# EAGLE schematic MikroE-334 (EAGLE 9.2.2)
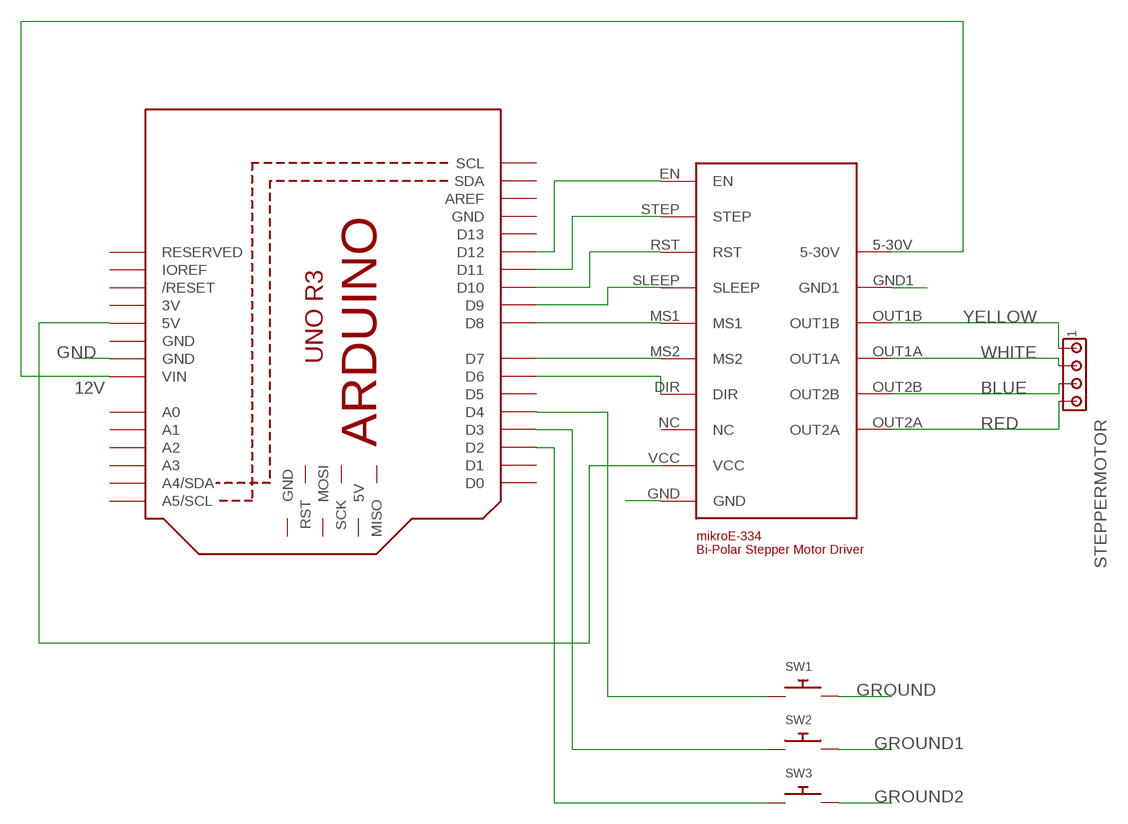
[diagram p0: schematic, sheet 1]

## Parts
M1  ARDUINO_R3_ICSP  [ARDUINOR3_ICSP]
STEPPERMOTOR  MTA04-156  [1X4MTA]
SW1  SWITCH_PUSHBUTTONEVQ-PE  [TACT_PANA-EVQ]
SW2  SWITCH_PUSHBUTTONEVQ-PE  [TACT_PANA-EVQ]
SW3  SWITCH_PUSHBUTTONEVQ-PE  [TACT_PANA-EVQ]
U$1  MIKROE-334  [MIKROE-334]

## Nets
12V: M1.VIN U$1.5-30V
BLUE: STEPPERMOTOR.3 U$1.OUT2B
GND: M1.GND@3(GND)
GROUND: SW1.P$2
GROUND1: SW2.P$2
GROUND2: SW3.P$2
N$1: M1.D12 U$1.EN
N$2: M1.D11 U$1.STEP
N$3: M1.D10 U$1.RST
N$4: M1.D9 U$1.SLEEP
N$5: M1.D8 U$1.MS1
N$6: M1.D7 U$1.MS2
N$7: M1.D6 U$1.DIR
N$9: U$1.GND1
N$10: M1.5V U$1.VCC
N$11: U$1.GND
N$12: M1.D4 SW1.P$1
N$13: M1.D3 SW2.P$1
N$14: M1.D2 SW3.P$1
RED: STEPPERMOTOR.4 U$1.OUT2A
WHITE: STEPPERMOTOR.2 U$1.OUT1A
YELLOW: STEPPERMOTOR.1 U$1.OUT1B
Unconnected: M1.5V_ICSP(5V) M1.A0 M1.A1 M1.A2 M1.A3 M1.A4(A4/SDA) M1.A5(A5/SCL) M1.AREF M1.D0 M1.D1 M1.D5 M1.D13 M1.GND@2(GND) M1.IOREF M1.MISO M1.MOSI M1.RESERVED M1.RESET(/RESET) M1.RESET_ICSP(RST) M1.SCK M1.SCL M1.SDA U$1.NC

## Power pins joined to a net without a drawn wire
3V: M1.3V
GND: M1.GND M1.GND@1(GND)

## Library data of the parts
M1 = adafruit:ARDUINO_R3_ICSP
STEPPERMOTOR = con-amp:MTA04-156: AMP connector
SW1-SW3 = adafruit:SWITCH_PUSHBUTTON: Buttons SOFTTOUCHSMD_SJ - Soft touch temporary push button (Super Junk Akihabara) Compatible with SKPMANE010 [Mouser: 688-SKPMAN] C&K_KSS = Digikey: KSS221GLFS
U$1 = mikroE-334:MIKROE-334